# EAGLE design untitled (EAGLE 9.5.0)
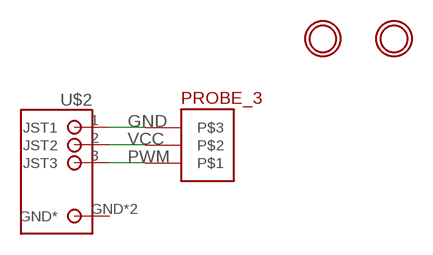
[diagram p0: schematic, sheet 1]

## Parts
U$1  CONTACT_PROBE_3  [PROBE_CONTACT]
U$2  S3B-PH-SM4_TB  [S3B-PH-SM4_TB]
U$4  MOUNTINGHOLE2.5  [MOUNTINGHOLE_2.5_PLATED]
U$49  MOUNTINGHOLE2.5  [MOUNTINGHOLE_2.5_PLATED]

## Nets
GND: U$1.P$3 U$2.1(JST1)
PWM: U$1.P$1 U$2.3(JST3)
VCC: U$1.P$2 U$2.2(JST2)
Unconnected: U$2.GND2(GND*) U$2.GND(GND*)

## Library data of the parts
U$1 = NewKevinMade:CONTACT_PROBE_3
U$2 = NewKevinMade:S3B-PH-SM4_TB
U$4 U$49 = microbuilder:MOUNTINGHOLE: Mounting Hole For #2 screws (0.086"/2.18mm width, 0.094"/2.4mm hole) use 2.5mm; BOM: EXCLUDE

## Board
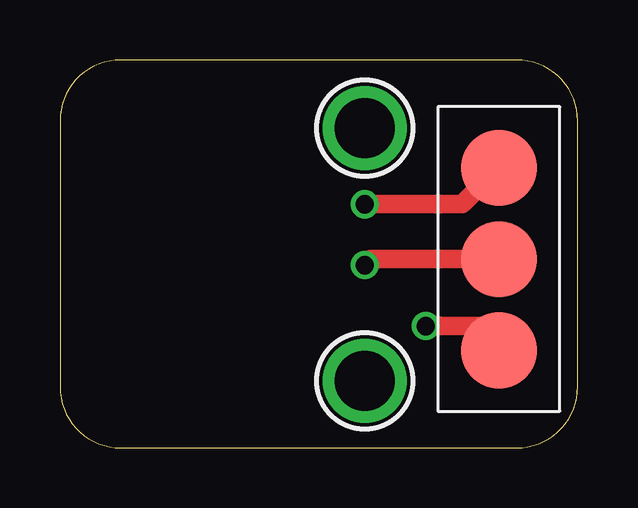
[diagram p1: board, top side]
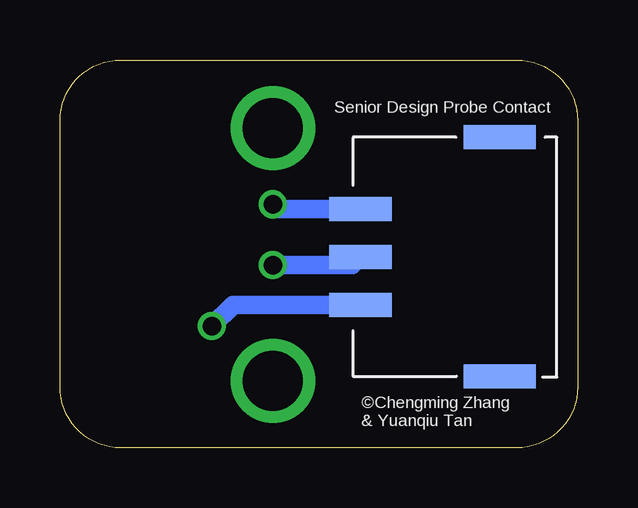
[diagram p2: board, bottom side, seen from below]

Size 21.57 x 16.18 mm. Coordinates in mm from the lower left corner, seen from the top.
Outline: 0,13.64 0,2.54 arc90 2.54,0 19.03,0 arc90 21.57,2.54 21.57,13.64 arc90 19.03,16.18 2.54,16.18 arc90 0,13.64
Copper layers (1*16): Top 0.035mm / dielectric 1.5mm / Bottom 0.035mm
Design rules "default *": minimum track width 6mil, minimum drill 0.35mm, track to track 6mil, track to pad 6mil, pad to pad 6mil, via to via 6mil, smd to smd 6mil, copper to edge 40mil, drill to drill 6mil, minimum pad ring 10mil, minimum via ring 8mil, stop-mask expansion 4mil, vias tented up to drill 30mil, thermal gap 10mil

### Footprints (pad centres in the part's own frame; a part is rotated, then mirrored left to right if it is on the bottom)
PROBE_CONTACT = smd 3.175 x 3.175: P$1 0,0; P$2 3.81,0; P$3 7.62,0
S3B-PH-SM4_TB = smd 1 x 2.6: 1 3.81,8.28; 2 5.81,8.28; 3 7.81,8.28 | smd 1 x 3: GND 0.826,2.48; GND2 10.794,2.48
MOUNTINGHOLE_2.5_PLATED = drill 2.5 pad 3.2: P$1 0,0

### Placement (x,y rotation side)
U$1  18.29,11.68 270 top
U$2  0.76,2.16 90 bottom
U$4  12.7,13.34 0 top
U$49  12.7,2.79 0 top

### Tracks (layer width: path | path; a pad name or v marks a point on that pad's centre or on a via)
GND  (via drill 0.76)
  Top 0.762: v15.24,5.08 17.78,5.08 19.05,3.81 18.54,3.81 U$1.P$3
  Bottom 0.762: U$2.1 14.35,5.97 v15.24,5.08
PWM  (via drill 0.76)
  Top 0.762: U$1.P$1 16.76,10.16 v12.7,10.16
  Bottom 0.762: v12.7,10.16 12.51,9.97 U$2.3
VCC  (via drill 0.76)
  Top 0.762: U$1.P$2 12.95,7.87 v12.7,7.62
  Bottom 0.762: v12.7,7.62 9.39,7.62 U$2.2

### Text on the board
bNames: Senior Design Probe Contact | ©Chengming Zhang / & Yuanqiu Tan